# EAGLE design esp32_master_board (EAGLE 9.7.0)
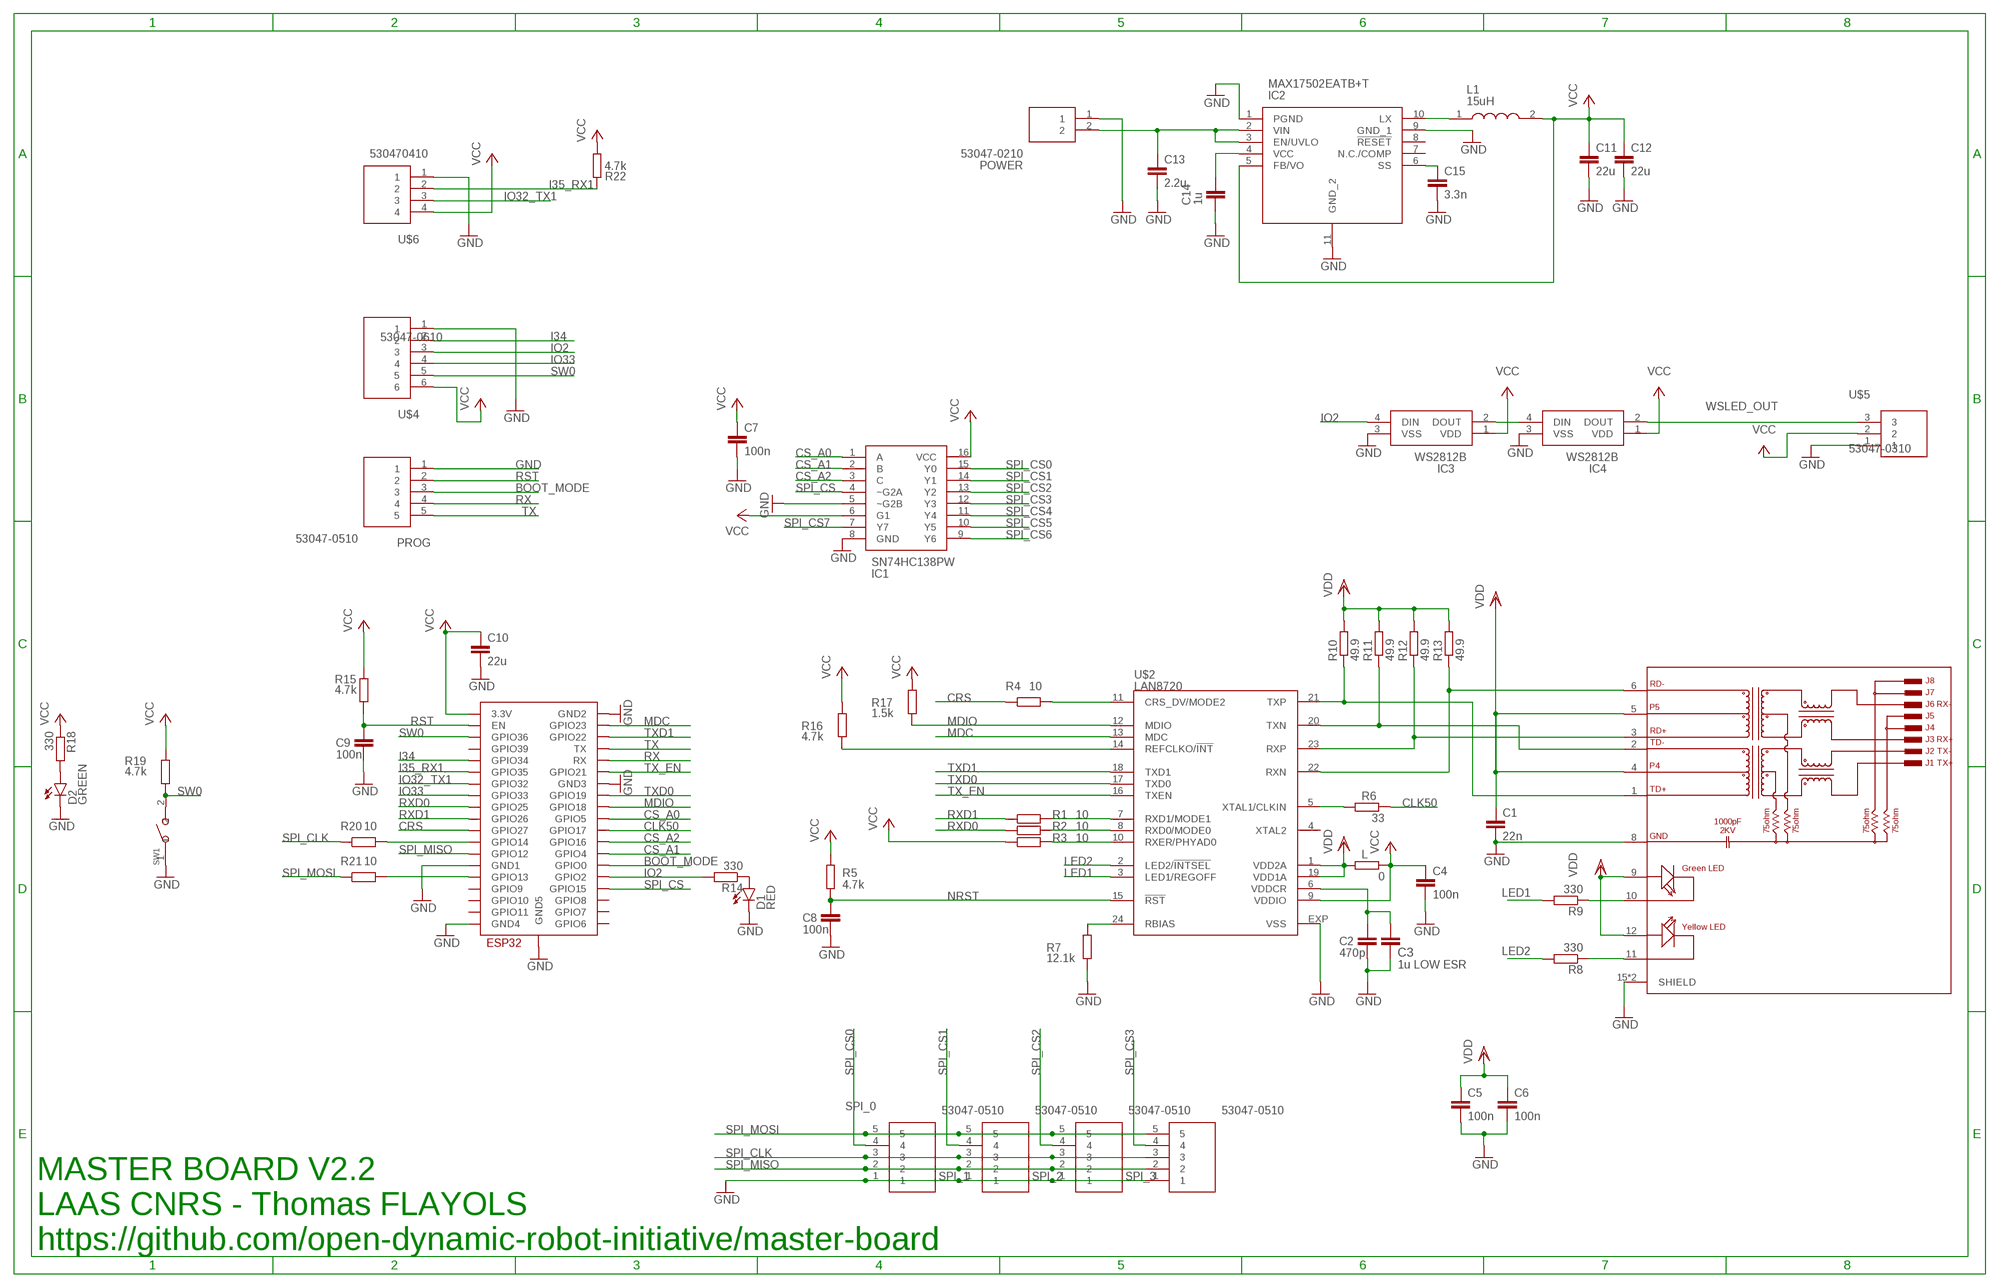
[diagram p0: schematic, sheet 1]

## Parts
C1  22n  C-EUC0402  [0402]
C2  470p  C-EUC0402  [0402]
C3  1u LOW ESR  C-EUC0402  [0402]
C4  100n  C-EUC0402  [0402]
C5  100n  C-EUC0402  [0402]
C6  100n  C-EUC0402  [0402]
C7  100n  C-EUC0402  [0402]
C8  100n  C-EUC0402  [0402]
C9  100n  C-EUC0402  [0402]
C10  22u  C-EUC0805  [C0805]
C11  22u  C-EUC0805  [C0805]
C12  22u  C-EUC0805  [C0805]
C13  2.2u  C-EUC1210  [C1210]
C14  1u  C-EUC0402  [0402]
C15  3.3n  C-EUC0402  [0402]
D1  RED  LEDCHIPLED_0603  [CHIPLED_0603]
D2  GREEN  LEDCHIPLED_0603  [CHIPLED_0603]
IC1  SN74HC138PW  [SOP65P640X120-16N]
IC2  MAX17502EATB+T  [SON50P200X300X80-11N]
IC3  WS2812B  [WS2812B]
IC4  WS2812B  [WS2812B]
L  0  R-EU_R0402  [0402]
L1  15uH  LPS6235-153MRB  [LPS6235]
POWER  53047-0210  [530470210]
PROG  53047-0510  [530470510]
R1  10  R-EU_R0402  [0402]
R2  10  R-EU_R0402  [0402]
R3  10  R-EU_R0402  [0402]
R4  10  R-EU_R0402  [0402]
R5  4.7k  R-EU_R0402  [0402]
R6  33  R-EU_R0402  [0402]
R7  12.1k  R-EU_R0402  [0402]
R8  330  R-EU_R0402  [0402]
R9  330  R-EU_R0402  [0402]
R10  49.9  R-EU_R0402  [0402]
R11  49.9  R-EU_R0402  [0402]
R12  49.9  R-EU_R0402  [0402]
R13  49.9  R-EU_R0402  [0402]
R14  330  R-EU_R0402  [0402]
R15  4.7k  R-EU_R0402  [0402]
R16  4.7k  R-EU_R0402  [0402]
R17  1.5k  R-EU_R0402  [0402]
R18  330  R-EU_R0402  [0402]
R19  4.7k  R-EU_R0402  [0402]
R20  10  R-EU_R0402  [0402]
R21  10  R-EU_R0402  [0402]
R22  4.7k  R-EU_R0402  [0402]
SPI_0  53047-0510  [530470510]
SPI_1  53047-0510  [530470510]
SPI_2  53047-0510  [530470510]
SPI_3  53047-0510  [530470510]
SW1  B3U-1000P-2P-SMD  SMD-BUTTON(2P-3.0X2.5X1.2+0.4MM)-B3U-1000P-2P-SMD  [SW2-2.6-3.0X2.5X1.2+0.4MM]
U$1  ESP32-WROOM  [ESP32-WROOM]
U$2  LAN8720  [QFN24]
U$3  HR911105A  [HANRUN_HR911105A]
U$4  53047-0610  [530470610]
U$5  53047-0310  [530470310]
U$6  530470410  [530470410]

## Nets
BOOT_MODE: PROG.3 U$1.IO0(GPIO0)
CLK50: R6.1 U$1.IO17(GPIO17)
CRS: R4.1 U$1.IO27(GPIO27)
CS_A0: IC1.1(A) U$1.IO5(GPIO5)
CS_A1: IC1.2(B) U$1.IO4(GPIO4)
CS_A2: IC1.3(C) U$1.IO16(GPIO16)
GND: C1.2 C2.2 C3.2 C4.2 C5.2 C6.2 C7.2 C8.2 C9.2 C10.2 C11.2 C12.2 C13.2 C14.1 C15.2 D1.C D2.C IC1.5(~G2B) IC1.8(GND) IC2.1(PGND) IC2.9(GND_1) IC2.11(GND_2) IC3.3(VSS) IC4.3(VSS) POWER.1 PROG.1 R7.1 SPI_0.1 SPI_1.1 SPI_2.1 SPI_3.1 SW1.1 U$1.GND1 U$1.GND2 U$1.GND3 U$1.GND4 U$1.GND5 U$2.EXP(VSS) U$3.8(GND) U$3.15(SHIELD) U$3.16(SHIELD) U$4.1 U$5.1 U$6.1
I34: U$1.IO34(GPIO34) U$4.2
I35_RX1: R22.2 U$1.IO35(GPIO35) U$6.2
IO2: IC3.4(DIN) R14.2 U$1.IO2(GPIO2) U$4.3
IO32_TX1: U$1.IO32(GPIO32) U$6.3
IO33: U$1.IO33(GPIO33) U$4.4
LED1: R9.2 U$2.3(LED1/REGOFF)
LED2: R8.2 U$2.2(LED2/!INTSEL)
MDC: U$1.IO23(GPIO23) U$2.13(MDC)
MDIO: R17.1 U$1.IO18(GPIO18) U$2.12(MDIO)
N$1: R1.2 U$2.7(RXD1/MODE1)
N$2: R2.2 U$2.8(RXD0/MODE0)
N$3: R3.2 U$2.10(RXER/PHYAD0)
N$4: R4.2 U$2.11(CRS_DV/MODE2)
N$5: R6.2 U$2.5(XTAL1/CLKIN)
N$6: R7.2 U$2.24(RBIAS)
N$7: R10.1 U$2.21(TXP) U$3.1(TD+)
N$8: R11.1 U$2.20(TXN) U$3.2(TD-)
N$9: R12.1 U$2.23(RXP) U$3.3(RD+)
N$10: R13.1 U$2.22(RXN) U$3.6(RD-)
N$11: R8.1 U$3.11(YC)
N$12: R9.1 U$3.10(GC)
N$13: R16.1 U$2.14(REFCLKO/!INT)
N$14: C2.1 C3.1 U$2.6(VDDCR)
N$15: C14.2 IC2.4(VCC)
N$16: D1.A R14.1
N$17: R21.2 U$1.IO13(GPIO13)
N$18: IC2.10(LX) L1.1
N$19: IC3.2(DOUT) IC4.4(DIN)
N$20: D2.A R18.2
N$21: R20.2 U$1.IO14(GPIO14)
N$23: C15.1 IC2.6(SS)
N$25: C13.1 IC2.2(VIN) IC2.3(EN/UVLO) POWER.2
NRST: C8.1 R5.1 U$2.15(!RST)
RST: C9.1 PROG.2 R15.1 U$1.EN
RX: PROG.4 U$1.RX
RXD0: R2.1 U$1.IO25(GPIO25)
RXD1: R1.1 U$1.IO26(GPIO26)
SPI_CLK: R20.1 SPI_0.3 SPI_1.3 SPI_2.3 SPI_3.3
SPI_CS: IC1.4(~G2A) U$1.IO15(GPIO15)
SPI_CS0: IC1.15(Y0) SPI_0.4
SPI_CS1: IC1.14(Y1) SPI_1.4
SPI_CS2: IC1.13(Y2) SPI_2.4
SPI_CS3: IC1.12(Y3) SPI_3.4
SPI_CS4: IC1.11(Y4)
SPI_CS5: IC1.10(Y5)
SPI_CS6: IC1.9(Y6)
SPI_CS7: IC1.7(Y7)
SPI_MISO: SPI_0.2 SPI_1.2 SPI_2.2 SPI_3.2 U$1.IO12(GPIO12)
SPI_MOSI: R21.1 SPI_0.5 SPI_1.5 SPI_2.5 SPI_3.5
SW0: R19.1 SW1.2 U$1.SENSOR_VP(GPIO36) U$4.5
TX: PROG.5 U$1.TX
TX_EN: U$1.IO21(GPIO21) U$2.16(TXEN)
TXD0: U$1.IO19(GPIO19) U$2.17(TXD0)
TXD1: U$1.IO22(GPIO22) U$2.18(TXD1)
VCC [power]: C4.1 C7.1 C10.1 C11.1 C12.1 IC1.6(G1) IC1.16(VCC) IC2.5(FB/VO) IC3.1(VDD) IC4.1(VDD) L1.2 L.1 R3.1 R5.2 R15.2 R16.2 R17.2 R18.1 R19.2 R22.1 U$1.3V3(3.3V) U$2.9(VDDIO) U$4.6 U$5.2 U$6.4
VDD [power]: C1.1 C5.1 C6.1 L.2 R10.2 R11.2 R12.2 R13.2 U$2.1(VDD2A) U$2.19(VDD1A) U$3.4 U$3.5 U$3.9(GA) U$3.12(YA)
WSLED_OUT: IC4.2(DOUT) U$5.3
Unconnected: IC2.7(N.C./COMP) IC2.8(!RESET) U$1.CLK(GPIO6) U$1.CMD(GPIO11) U$1.SD0(GPIO7) U$1.SD1(GPIO8) U$1.SD2(GPIO9) U$1.SD3(GPIO10) U$1.SENSOR_VN(GPIO39) U$2.4(XTAL2)

## Notes on the sheet
- MASTER BOARD V2.2
  LAAS CNRS - Thomas FLAYOLS
  https://github.com/open-dynamic-robot-initiative/master-board

## Library data of the parts
C1 = resistor:C-EU: CAPACITOR, European symbol; MANUFACTURER_PART_NUMBER: 885012205052
C2 = resistor:C-EU: CAPACITOR, European symbol; MANUFACTURER_PART_NUMBER: CL05C471JB5NNNC
C3 C14 = resistor:C-EU: CAPACITOR, European symbol; MANUFACTURER_PART_NUMBER: CPL-CAP-X5R-0402-1UF-6.3V
C4-C9 = resistor:C-EU: CAPACITOR, European symbol; MANUFACTURER_PART_NUMBER: CPL-CAP-X7R-0402-100NF-16V
C10-C12 = rcl:C-EU: CAPACITOR, European symbol; MANUFACTURER_PART_NUMBER: CPL-CAP-X5R-0805-22UF-6.3V; SPICEPREFIX: C
C13 = resistor:C-EU: CAPACITOR, European symbol; MANUFACTURER_PART_NUMBER: C3225X7R1H225K250AB
C15 = resistor:C-EU: CAPACITOR, European symbol; MANUFACTURER_PART_NUMBER: 885012205064
D1 = led:LED: LED OSRAM: - CHIPLED LG R971, LG N971, LY N971, LG Q971, LY Q971, LO R971, LY R971 LH N974, LH R974 LS Q976, LO Q976, LY Q976 LO Q996 - Hyper CHIPLED LW Q18S LB Q993, LB Q99A, LB R99A - SideLED LS A670, LO A670, LY A670, LG A670, LP A670 LB A673, LV A673, LT A673, LW A673 LH A674 LY A675 LS A676, LA A676, LO A676, LY A676, LW A676 LS A679, LY A679, LG A679 - Hyper Micro SIDELED® LS Y876, LA Y876, LO Y876, LY Y876 LT Y87S - SmartLED LW L88C, LW L88S LB L89C, LB L89S, LG L890 LS L89K, LO L89K, LY L89K LS L896, LA L896, LO L896, LY L896 - TOPLED LS T670, LO T670, LY T670, LG T670, LP T670 LSG T670, LSP T670, LSY T670, LOP T670, LYG T670 LG T671, LOG T671, LSG T671 LB T673, LV T673, LT T673, LW T673 LH T674 LS T676, LA T676, LO T676, LY T676, LB T676, LH T676, LSB T676, LW T676 LB T67C, LV T67C, LT T67C, LS T67K, LO T67K, LY T67K, LW E67C LS E67B, LA E67B, LO E67B, LY E67B, LB E67C, LV E67C, LT E67C LW T67C LS T679, LY T679, LG T679 LS T770, LO T770, LY T770, LG T770, LP T770 LB T773, LV T773, LT T773, LW T773 LH T774 LS E675, LA E675, LY E675, LS T675 LS T776, LA T776, LO T776, LY T776, LB T776 LHGB T686 LT T68C, LB T68C - Hyper Mini TOPLED® LB M676 - Mini TOPLED Santana® LG M470 LS M47K, LO M47K, LY M47K Source: http://www.osram.convergy.de LUXEON: - LUMILED® LXK2-PW12-R00, LXK2-PW12-S00, LXK2-PW14-U00, LXK2-PW14-V00 LXK2-PM12-R00, LXK2-PM12-S00, LXK2-PM14-U00 LXK2-PE12-Q00, LXK2-PE12-R00, LXK2-PE12-S00, LXK2-PE14-T00, LXK2-PE14-U00 LXK2-PB12-K00, LXK2-PB12-L00, LXK2-PB12-M00, LXK2-PB14-N00, LXK2-PB14-P00, LXK2-PB14-Q00 LXK2-PR12-L00, LXK2-PR12-M00, LXK2-PR14-Q00, LXK2-PR14-R00 LXK2-PD12-Q00, LXK2-PD12-R00, LXK2-PD12-S00 LXK2-PH12-R00, LXK2-PH12-S00 LXK2-PL12-P00, LXK2-PL12-Q00, LXK2-PL12-R00 Source: www.luxeon.com KINGBRIGHT: KA-3528ASYC Source: www.kingbright.com; MANUFACTURER_PART_NUMBER: CPL-LED-0603-RED
D2 = led:LED: LED OSRAM: - CHIPLED LG R971, LG N971, LY N971, LG Q971, LY Q971, LO R971, LY R971 LH N974, LH R974 LS Q976, LO Q976, LY Q976 LO Q996 - Hyper CHIPLED LW Q18S LB Q993, LB Q99A, LB R99A - SideLED LS A670, LO A670, LY A670, LG A670, LP A670 LB A673, LV A673, LT A673, LW A673 LH A674 LY A675 LS A676, LA A676, LO A676, LY A676, LW A676 LS A679, LY A679, LG A679 - Hyper Micro SIDELED® LS Y876, LA Y876, LO Y876, LY Y876 LT Y87S - SmartLED LW L88C, LW L88S LB L89C, LB L89S, LG L890 LS L89K, LO L89K, LY L89K LS L896, LA L896, LO L896, LY L896 - TOPLED LS T670, LO T670, LY T670, LG T670, LP T670 LSG T670, LSP T670, LSY T670, LOP T670, LYG T670 LG T671, LOG T671, LSG T671 LB T673, LV T673, LT T673, LW T673 LH T674 LS T676, LA T676, LO T676, LY T676, LB T676, LH T676, LSB T676, LW T676 LB T67C, LV T67C, LT T67C, LS T67K, LO T67K, LY T67K, LW E67C LS E67B, LA E67B, LO E67B, LY E67B, LB E67C, LV E67C, LT E67C LW T67C LS T679, LY T679, LG T679 LS T770, LO T770, LY T770, LG T770, LP T770 LB T773, LV T773, LT T773, LW T773 LH T774 LS E675, LA E675, LY E675, LS T675 LS T776, LA T776, LO T776, LY T776, LB T776 LHGB T686 LT T68C, LB T68C - Hyper Mini TOPLED® LB M676 - Mini TOPLED Santana® LG M470 LS M47K, LO M47K, LY M47K Source: http://www.osram.convergy.de LUXEON: - LUMILED® LXK2-PW12-R00, LXK2-PW12-S00, LXK2-PW14-U00, LXK2-PW14-V00 LXK2-PM12-R00, LXK2-PM12-S00, LXK2-PM14-U00 LXK2-PE12-Q00, LXK2-PE12-R00, LXK2-PE12-S00, LXK2-PE14-T00, LXK2-PE14-U00 LXK2-PB12-K00, LXK2-PB12-L00, LXK2-PB12-M00, LXK2-PB14-N00, LXK2-PB14-P00, LXK2-PB14-Q00 LXK2-PR12-L00, LXK2-PR12-M00, LXK2-PR14-Q00, LXK2-PR14-R00 LXK2-PD12-Q00, LXK2-PD12-R00, LXK2-PD12-S00 LXK2-PH12-R00, LXK2-PH12-S00 LXK2-PL12-P00, LXK2-PL12-Q00, LXK2-PL12-R00 Source: www.luxeon.com KINGBRIGHT: KA-3528ASYC Source: www.kingbright.com; MANUFACTURER_PART_NUMBER: CPL-LED-0603-GREEN
IC1 = SamacSys_Parts:SN74HC138PW: Texas Instruments SN74HC138PW, Decoder, Demultiplexer, 1-of-8, Inverting, 2 6 V, 16-Pin TSSOP Source: Datasheet <http://www.ti.com/lit/gpn/sn74hc138>; DESCRIPTION: Texas Instruments SN74HC138PW, Decoder, Demultiplexer, 1-of-8, Inverting, 2 6 V, 16-Pin TSSOP; HEIGHT: mm; MANUFACTURER_NAME: Texas Instruments; MANUFACTURER_PART_NUMBER: SN74HC138PW; RS_PART_NUMBER: 6631928; RS_PRICE-STOCK: https://uk.rs-online.com/web/p/products/6631928
IC2 = MAX17502EATB+T:MAX17502EATB+T: MAXIM INTEGRATED PRODUCTS - MAX17502EATB+T - DC/DC CONV, SYNC BUCK, 600KHZ, 125DEG C Source: Datasheet <https://datasheets.maximintegrated.com/en/ds/MAX17502.pdf>; DESCRIPTION: MAXIM INTEGRATED PRODUCTS - MAX17502EATB+T - DC/DC CONV, SYNC BUCK, 600KHZ, 125DEG C; HEIGHT: 0.8mm; MANUFACTURER_NAME: Maxim Integrated; MANUFACTURER_PART_NUMBER: MAX17502EATB+T; MOUSER_PART_NUMBER: 700-MAX17502EATB+T; MOUSER_PRICE-STOCK: https://www.mouser.com/Search/Refine.aspx?Keyword=700-MAX17502EATB%2BT
IC3 IC4 = WS2812B:WS2812B: Intelligent control LED integrated light source Source: Datasheet <https://www.adafruit.com/datasheets/WS2812B.pdf>; DESCRIPTION: Intelligent control LED integrated light source; HEIGHT: mm; MANUFACTURER_NAME: Worldsemi; MANUFACTURER_PART_NUMBER: WS2812B
L = resistor:R-EU_: RESISTOR, European symbol; MANUFACTURER_PART_NUMBER: CPL-RES-0402-0-0.063W
L1 = LPS6235-153MRB:LPS6235-153MRB: COILCRAFT - LPS6235-153MRB - INDUCTOR, SHLD, 15UH, 20%, 1.7A, SMD Source: Datasheet <https://www.mouser.fr/datasheet/2/597/lps6235-270704.pdf>; DESCRIPTION: COILCRAFT - LPS6235-153MRB - INDUCTOR, SHLD, 15UH, 20%, 1.7A, SMD; HEIGHT: mm; MANUFACTURER_NAME: COILCRAFT; MANUFACTURER_PART_NUMBER: LPS6235-153MRB; MOUSER_PART_NUMBER: 994-LPS6235-153MRB; MOUSER_PRICE-STOCK: https://www.mouser.com/Search/Refine.aspx?Keyword=994-LPS6235-153MRB
POWER = 53047-0210:53047-0210: Headers & Wire Housings VERTICAL HDR 2P Source: Datasheet <https://componentsearchengine.com/Datasheets/2/53047-0210.pdf>; DESCRIPTION: Headers & Wire Housings VERTICAL HDR 2P; HEIGHT: 4.4mm; MANUFACTURER_NAME: Molex; MANUFACTURER_PART_NUMBER: DF13-3P-1.25DSA; MOUSER_PART_NUMBER: 538-53047-0210; MOUSER_PRICE-STOCK: https://www.mouser.co.uk/ProductDetail/Molex/53047-0210?qs=M5Ic86%252BuP8b8FQrTwriyOw%3D%3D
PROG SPI_0 SPI_1-SPI_3 = 53047-0510:53047-0510: Headers & Wire Housings VERTICAL HDR 5P Source: Datasheet <https://www.molex.com/pdm_docs/sd/530470210_sd.pdf>; ARROW_PART_NUMBER: 53047-0510; ARROW_PRICE-STOCK: https://www.arrow.com/en/products/53047-0510/molex?region=nac; DESCRIPTION: Headers & Wire Housings VERTICAL HDR 5P; HEIGHT: 4.2mm; MANUFACTURER_NAME: Molex; MANUFACTURER_PART_NUMBER: DF13-5P-1.25DSA; MOUSER_PART_NUMBER: 538-53047-0510; MOUSER_PRICE-STOCK: https://www.mouser.co.uk/ProductDetail/Molex/53047-0510?qs=KC2ywxza1koXSHAr3dqR%2FQ%3D%3D
R1-R4 R20 R21 = resistor:R-EU_: RESISTOR, European symbol; MANUFACTURER_PART_NUMBER: CPL-RES-0402-10-0.063W
R5 R15 R16 R19 R22 = resistor:R-EU_: RESISTOR, European symbol; MANUFACTURER_PART_NUMBER: CPL-RES-0402-4.7K-0.063W
R6 = resistor:R-EU_: RESISTOR, European symbol; MANUFACTURER_PART_NUMBER: CRCW040233R0FKEDC
R7 = resistor:R-EU_: RESISTOR, European symbol; MANUFACTURER_PART_NUMBER: ERJ-U02F1212X
R8 R9 R14 R18 = resistor:R-EU_: RESISTOR, European symbol; MANUFACTURER_PART_NUMBER: RC0402JR-13330RL
R10-R13 = resistor:R-EU_: RESISTOR, European symbol; MANUFACTURER_PART_NUMBER: CRCW040249R9FKEDC
R17 = resistor:R-EU_: RESISTOR, European symbol; MANUFACTURER_PART_NUMBER: ERJ2GEJ152X
SW1 = OPL_Switch:SMD-BUTTON(2P-3.0X2.5X1.2+0.4MM): 311020047; MANUFACTURER_PART_NUMBER: B3U-1000P; MPN: B3U-1000P-2P-SMD
U$1 = ESP32:ESP32-WROOM; MANUFACTURER_PART_NUMBER: ESP32-WROOM-32D
U$2 = microchip-smsc-lan8720:LAN8720: LAN8720A/LAN8720Ai Small Footprint RMII 10/100 Ethernet PHY Transceiver with HP Auto-MDIX Support from SMSC / Microchip <http://www.microchip.com>. (C) 2014 Tomasz Boleslaw CEDRO, cederom@tlen.pl, http://www.tomek.cedro.info. Version 0.1 (2014-01-04): Initial release.; MANUFACTURER_PART_NUMBER: LAN8720A-CP
U$3 = HR911105A_bis:HR911105A: DIP RJ45 Connector; Check prices <https://pricing.snapeda.com/parts/HR911105A/DFRobot/view-part?ref=eda>; AVAILABILITY: Not in stock; DESCRIPTION: HR911105A Ethernet Interface Arduino Platform Evaluation Expansion Board; MANUFACTURER_PART_NUMBER: HR911105A; MF: DFRobot; MP: HR911105A; PACKAGE: None; PRICE: None
U$4 = 53047-0610:53047-0610: Headers & Wire Housings VERTICAL HDR 6P Source: Datasheet <https://www.molex.com/pdm_docs/sd/530470210_sd.pdf>; DESCRIPTION: Headers & Wire Housings VERTICAL HDR 6P; HEIGHT: 4.2mm; MANUFACTURER_NAME: Molex; MANUFACTURER_PART_NUMBER: DF13-6P-1.25DSA; MOUSER_PART_NUMBER: 538-53047-0610; MOUSER_PRICE-STOCK: https://www.mouser.co.uk/ProductDetail/Molex/53047-0610?qs=W6FIH8d5%2F%2F2fC3kTOlN%2FUQ%3D%3D
U$5 = 53047-0310:53047-0310: Headers & Wire Housings VERTICAL HDR 3P Source: Datasheet <https://www.molex.com/pdm_docs/sd/530470310_sd.pdf>; ARROW_PART_NUMBER: 53047-0310; ARROW_PRICE-STOCK: https://www.arrow.com/en/products/53047-0310/molex?region=nac; DESCRIPTION: Headers & Wire Housings VERTICAL HDR 3P; HEIGHT: 4.4mm; MANUFACTURER_NAME: Molex; MANUFACTURER_PART_NUMBER: DF13-3P-1.25DSA; MOUSER_PART_NUMBER: 538-53047-0310; MOUSER_PRICE-STOCK: https://www.mouser.co.uk/ProductDetail/Molex/53047-0310?qs=WvGHgJyR8NxkapfSzLYEEg%3D%3D
U$6 = 530470410:530470410: 1.25mm Pitch, PicoBlade PCB Header, Single Row, Vertical, Through Hole, Tin Plating, Friction Lock, 4 Circuits, Tray, 2.30mm PC Tail Length Source: Datasheet <https://www.molex.com/pdm_docs/sd/530470210_sd.pdf>; ARROW_PART_NUMBER: 530470410; ARROW_PRICE-STOCK: https://www.arrow.com/en/products/53047-0410/molex?region=nac; DESCRIPTION: 1.25mm Pitch, PicoBlade PCB Header, Single Row, Vertical, Through Hole, Tin Plating, Friction Lock, 4 Circuits, Tray, 2.30mm PC Tail Length; HEIGHT: 4.2mm; MANUFACTURER_NAME: Molex; MANUFACTURER_PART_NUMBER: DF13-4P-1.25DSA

## Net classes
1 power: width 0.406 mm

## Board
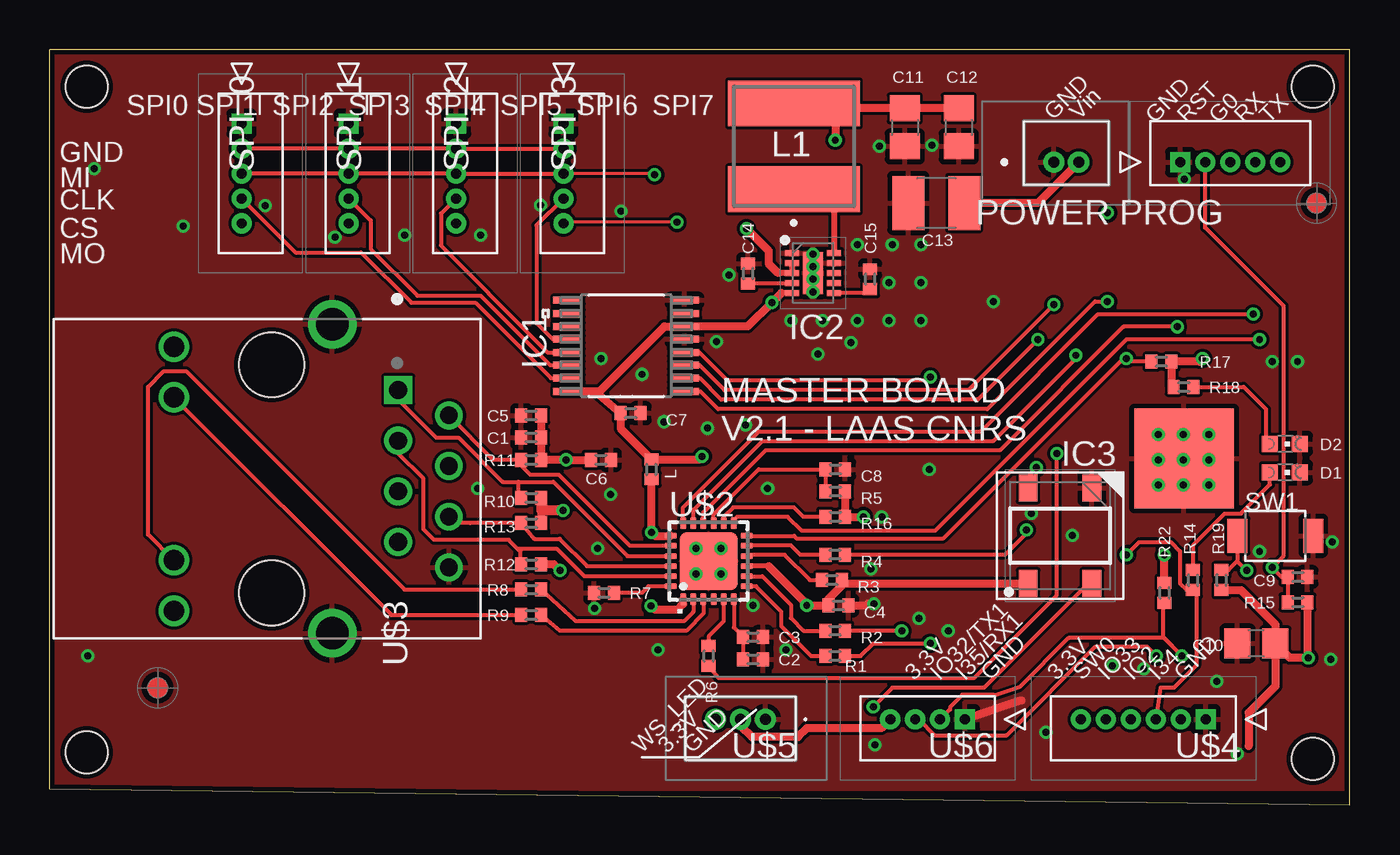
[diagram p1: board, top side]
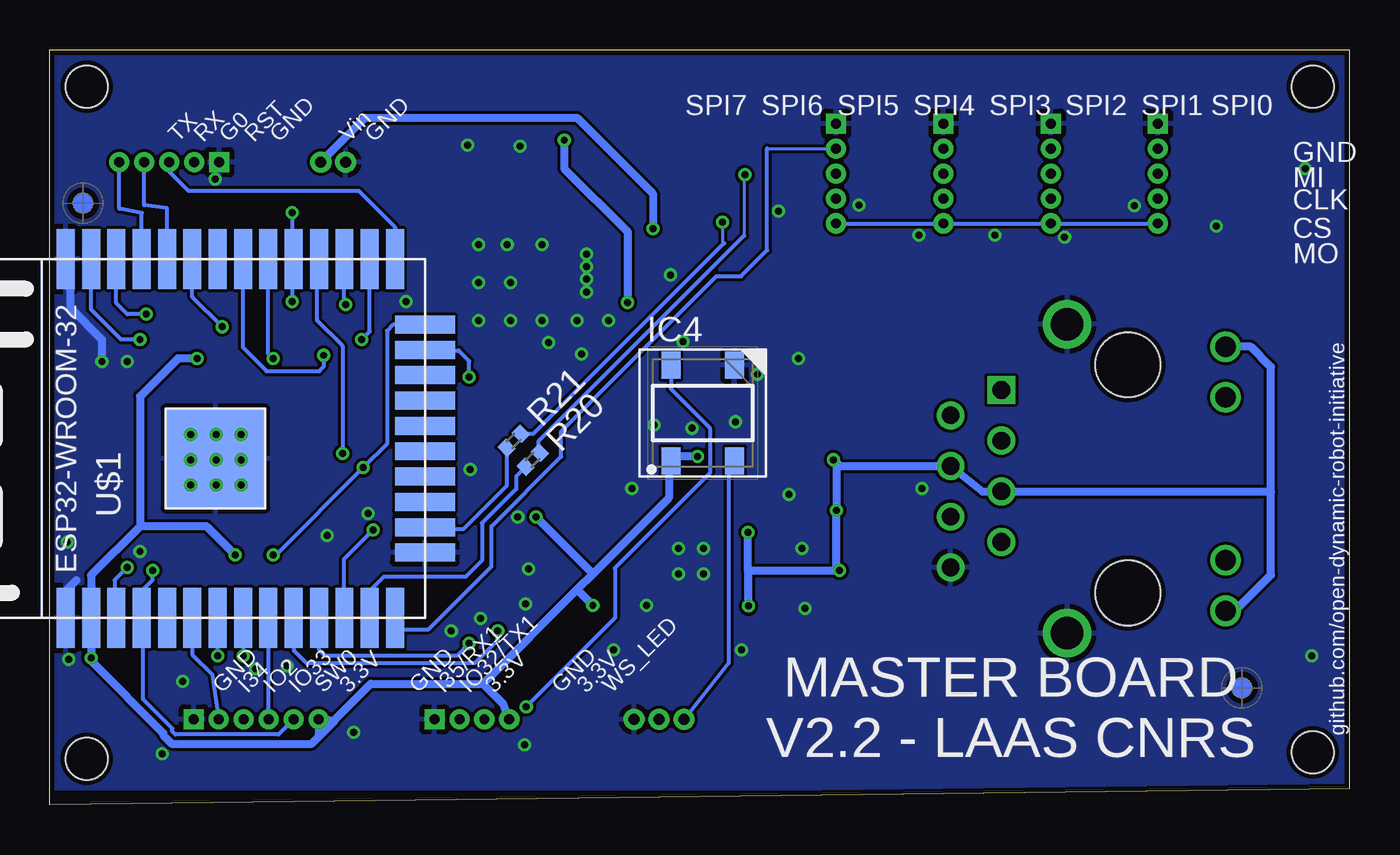
[diagram p2: board, bottom side, seen from below]

Size 65.16 x 37.86 mm. Coordinates in mm from the lower left corner, seen from the top.
Outline: 0,37.86 65.16,37.86 65.16,0 0,0.79 0,37.85
Copper layers (1*16): Top 0.035mm / dielectric 1.5mm / Bottom 0.035mm
Design rules "SeeedStudio": minimum track width 6mil, minimum drill 12mil, track to track 6mil, track to pad 6mil, pad to pad 6mil, via to via 6mil, smd to smd 0mil, copper to edge 10mil, drill to drill 10mil, minimum pad ring 10mil, minimum via ring 6mil, stop-mask expansion 2mil, vias tented up to drill 100mil, thermal gap 10mil
Holes 2.1 mm at 1.84,36.02 1.84,2.64 63.32,2.32 63.32,36.02

### Footprints (pad centres in the part's own frame; a part is rotated, then mirrored left to right if it is on the bottom)
0402 = smd 0.6 x 0.7: 1 -0.5,0; 2 0.5,0
C0805 = smd 1.3 x 1.5: 1 -0.95,0; 2 0.95,0
C1210 = smd 1.6 x 2.7: 1 -1.4,0; 2 1.4,0
CHIPLED_0603 = smd 0.8 x 0.8: A 0,-0.75; C 0,0.75
SOP65P640X120-16N = smd 1.473 x 0.356: 1 -2.921,2.286; 2 -2.921,1.626; 3 -2.921,0.965; 4 -2.921,0.33; 5 -2.921,-0.33; 6 -2.921,-0.965; 7 -2.921,-1.626; 8 -2.921,-2.286; 9 2.921,-2.286; 10 2.921,-1.626; 11 2.921,-0.965; 12 2.921,-0.33; 13 2.921,0.33; 14 2.921,0.965; 15 2.921,1.626; 16 2.921,2.286
SON50P200X300X80-11N = smd 0.7 x 0.3: 1 -1.05,1; 2 -1.05,0.5; 3 -1.05,0; 4 -1.05,-0.5; 5 -1.05,-1; 6 1.05,-1; 7 1.05,-0.5; 8 1.05,0; 9 1.05,0.5; 10 1.05,1 | smd 1 x 2.1: 11 0,0
WS2812B = smd 1.35 x 0.95: 1 -2.4,1.6; 2 -2.4,-1.6; 3 2.4,-1.6; 4 2.4,1.6
LPS6235 = smd 2.3 x 6.6: 1 -2.15,0; 2 2.15,0
530470210 = drill 0.55 pad 1: 1 0,0; 2 -1.25,0
530470510 = drill 0.5 pad 0.85 square: 1 0,0 | drill 0.5 pad 0.85: 2 -1.25,0; 3 -2.5,0; 4 -3.75,0; 5 -5,0
SW2-2.6-3.0X2.5X1.2+0.4MM = smd 1 x 1.7: 1 -1.9,0; 2 1.9,0
ESP32-WROOM = smd 3 x 0.9: 3V3 0,16.74; EN 0,15.47; GND1 0,18.01; GND3 18,18.01; IO0 18,1.5; IO4 18,2.77; IO5 18,6.58; IO12 0,1.5; IO14 0,2.77; IO16 18,4.04; IO17 18,5.31; IO18 18,7.85; IO19 18,9.12; IO21 18,11.66; IO22 18,15.47; IO23 18,16.74; IO25 0,6.58; IO26 0,5.31; IO27 0,4.04; IO32 0,9.12; IO33 0,7.85; IO34 0,11.66; IO35 0,10.39; NC 18,10.39; RX 18,12.93; SENSOR_VN 0,12.93; SENSOR_VP 0,14.2; TX 18,14.2 | smd 0.9 x 3: CLK 9.635,0; CMD 8.365,0; GND2 3.285,0; IO2 14.715,0; IO13 4.555,0; IO15 13.445,0; SD0 10.905,0; SD1 12.175,0; SD2 5.825,0; SD3 7.095,0 | smd 5 x 5: GND4 8,10.5 | smd 5 x 5 bottom: GND5 8,10.5
QFN24 = smd 0.6 x 0.3: 1 -1.905,1.27; 2 -1.905,0.762; 3 -1.905,0.254; 4 -1.905,-0.254; 5 -1.905,-0.762; 6 -1.905,-1.27; 13 1.905,-1.27; 14 1.905,-0.762; 15 1.905,-0.254; 16 1.905,0.254; 17 1.905,0.762; 18 1.905,1.27 | smd 0.3 x 0.6: 7 -1.27,-1.905; 8 -0.762,-1.905; 9 -0.254,-1.905; 10 0.254,-1.905; 11 0.762,-1.905; 12 1.27,-1.905; 19 1.27,1.905; 20 0.762,1.905; 21 0.254,1.905; 22 -0.254,1.905; 23 -0.762,1.905; 24 -1.27,1.905 | smd 2.9 x 2.9: EXP 0,0
HANRUN_HR911105A = drill 0.89 square: 1 4.45,-6.35 | drill 0.89: 2 3.18,-8.89; 3 1.91,-6.35; 4 0.64,-8.89; 5 -0.63,-6.35; 6 -1.9,-8.89; 7 -3.17,-6.35; 8 -4.44,-8.89 | drill 1.02: 9 6.625,4.9; 10 4.085,4.9; 11 -4.085,4.9; 12 -6.625,4.9 | drill 1.63: 15 7.745,-3.05; 16 -7.745,-3.05 | hole 3.25: -5.715,0; 5.715,0
530470610 = drill 0.5 pad 0.85 square: 1 0,0 | drill 0.5 pad 0.85: 2 -1.25,0; 3 -2.5,0; 4 -3.75,0; 5 -5,0; 6 -6.25,0
530470310 = drill 0.55 pad 0.9: 1 0,0; 2 -1.25,0; 3 -2.5,0
530470410 = drill 0.5 pad 0.85 square: 1 0,0 | drill 0.5 pad 0.85: 2 -1.25,0; 3 -2.5,0; 4 -3.75,0

### Placement (x,y rotation side)
C1  24.13,18.41 180 top
C2  35.24,7.3 0 top
C3  35.24,8.41 0 top
C4  39.53,10 0 top
C5  24.13,19.53 180 top
C6  27.62,17.3 0 top
C7  29.11,19.64 0 top
C8  39.37,16.83 0 top
C9  62.55,11.43 0 top
C10  60.48,8.1 180 top
C11  42.86,33.97 270 top
C12  45.56,33.97 270 top
C13  44.44,30.18 180 top
C14  35.01,26.64 270 top
C15  41.12,26.35 90 top
D1  61.91,16.67 270 top
D2  61.91,18.1 270 top
IC1  28.89,23.02 180 top
IC2  38.26,26.67 0 top
IC3  50.64,13.49 90 top
IC4  32.43,19.65 90 bottom
L  30.16,16.83 270 top
L1  37.31,33.02 90 top
POWER  50.32,32.23 180 top
PROG  56.67,32.23 180 top
R1  39.37,7.46 180 top
R2  39.37,8.73 180 top
R3  39.21,11.27 180 top
R4  39.37,12.54 180 top
R5  39.37,15.72 0 top
R6  33.02,7.46 90 top
R7  27.78,10.64 0 top
R8  24.13,10.79 0 top
R9  24.13,9.53 0 top
R10  24.13,15.4 0 top
R11  24.13,17.3 0 top
R12  24.13,12.07 0 top
R13  24.13,14.13 0 top
R14  57.31,11.27 270 top
R15  62.55,10.16 0 top
R16  39.37,14.45 0 top
R17  55.72,22.22 0 top
R18  56.83,20.95 0 top
R19  58.74,11.27 270 top
R20  40.96,17.3 225 bottom
R21  41.91,18.26 225 bottom
R22  55.88,10.64 270 top
REF1  [VISION_REF10]  5.4,5.87 0 bottom
REF2  [VISION_REF10]  63.5,30.16 0 bottom
REF3  [VISION_REF10]  5.4,5.87 0 top
REF4  [VISION_REF10]  63.5,30.16 0 top
SPI_0  9.61,34.16 90 top
SPI_1  14.99,34.16 90 top
SPI_2  20.36,34.16 90 top
SPI_3  25.74,34.16 90 top
SW1  61.44,13.49 180 top
U$1  46.35,9.37 90 bottom
U$2  33.02,12.22 90 top
U$3  11.11,16.35 90 top
U$4  57.94,4.29 0 top
U$5  35.88,4.29 0 top
U$6  45.88,4.29 0 top

### Tracks (layer width: path | path; a pad name or v marks a point on that pad's centre or on a via)
BOOT_MODE
  Bottom 0.203: PROG.3 59.17,31.75 58.22,30.8 49.69,30.8 47.85,28.96 U$1.IO0
CLK50  (via drill 0.35)
  Top 0.203: v50.48,17.62 50.45,17.59 50.45,10.48 46.32,6.35 33.53,6.35 R6.1
  Bottom 0.203: v50.48,17.62 50.48,23.02 51.75,24.29 51.75,27.28 U$1.IO17
CRS  (via drill 0.35)
  Top 0.203: v48.95,13.78 48.95,13.62 47.87,12.54 R4.1
  Bottom 0.203: v48.95,13.78 50.4,12.34 U$1.IO27
CS_A0  (via drill 0.35)
  Top 0.203: IC1.1 32.61,20.73 33.5,19.84 46.99,19.84 52.39,25.24 v53.02,25.24
  Bottom 0.203: v53.02,29.69 53.02,27.45 U$1.IO5 53.02,27.28 v53.02,25.24
CS_A1  (via drill 0.35)
  Top 0.203: IC1.2 32.58,21.39 33.66,20.32 46.51,20.32 v49.53,23.34
  Bottom 0.203: U$1.IO4 49.12,23.74 v49.53,23.34
CS_A2  (via drill 0.35)
  Top 0.203: IC1.3 32.56,22.05 33.81,20.8 46.04,20.8 v50.32,25.08
  Bottom 0.203: U$1.IO16 50.4,25.15 v50.32,25.08
GND  (via drill 0.35)
  Top 0.406: U$2.EXP v32.38,12.86 | U$2.EXP v33.66,11.59 | U$2.EXP v32.38,11.59 | U$2.EXP v33.66,12.86 | C4.2 40.92,10 41,10.08 v41.32,10.08 | 48.71,5.24 U$6.1
  Bottom 0.203: U$1.GND1 64.36,10.72 | 64.36,26.11 U$1.GND3 | U$1.GND4 56.9,17.37 v58.1,18.57 | U$1.GND4 55.65,18.57 v55.56,18.57 | U$1.GND4 55.56,16.07 v55.56,16.03 | U$1.GND4 58.1,16.12 v58.1,16.03
  Bottom 0.406: 64.36,10.72 63.82,11.27 | 64.36,26.11 64.14,25.88 64.14,24.92 62.55,23.34 v62.55,22.22
  other vias: 56.83,17.3 56.83,18.57 55.56,17.3 56.83,16.03 58.1,17.3 47.31,25.24 64.29,13.18 2.22,31.91 1.91,7.46 30.48,7.78 27.62,22.38 28.1,15.56 44.22,33.08 30.8,19.21 60.64,12.7 27.46,12.86 49.2,14.62 44.08,16.82 35.24,10 27.3,9.84 43.57,9.36 29.69,21.59 38.26,26.35 38.26,26.99 38.26,27.62 38.26,25.72 45.03,8.72 35.99,15.87 33.42,23.24 38.5,22.61 32.97,18.88 34.87,19.04 41.16,11.83 34.06,26.57 51.26,13.51 36.91,7.77 53.26,6.98 21.43,15.88 41.35,3.01 54.84,6.82 61.28,22.22 40.16,23.18 41.59,33.02 58.5,6.18 41.7,14.44 37.15,24.29 40.48,24.29 42.07,24.29 43.66,24.29 43.66,26.19 38.73,24.29 40.48,28.1 43.66,28.1 42.23,28.1 42.07,26.19 64.21,7.3 49.92,3.64 17.78,28.58 21.59,28.58 24.59,30.08 6.69,29.03 14.29,28.46 10.79,30.04 56.87,31.38 28.62,29.77 59.52,2.57
  pour Top: 0,0.79 65.16,0.79 65.16,37.86 0,37.86
  pour Bottom: 0,0.79 65.16,0.79 65.16,37.86 0,37.86
I34
  Bottom 0.203: U$1.IO34 58.02,7.53 57.01,6.53 U$4.2
I35_RX1  (via drill 0.35)
  Top 0.203: R22.2 55.8,10.06 55.8,8.42 v56.76,7.47 55.87,8.36 51.06,8.36 48.6,5.89 47.33,5.47 47.28,5.52 45.75,5.52 45.12,4.9 45.12,4.78 U$6.2
  Bottom 0.203: U$1.IO35 56.74,7.48 v56.76,7.47
IO2  (via drill 0.35)
  Top 0.203: IC3.4 49.13,15.99 49.13,16.59 v49.45,16.91 | v53.98,12.54 54.61,13.18 56.2,13.18 56.66,12.72 56.66,11.1 56.99,10.77 R14.2 57.47,10.61 57.47,6.98 56.36,5.87 55.68,5.87 U$4.3
  Bottom 0.203: U$1.IO2 47.94,24.08 48.26,23.76 48.26,18.1 v49.45,16.91 53.82,12.54 v53.98,12.54
IO32_TX1  (via drill 0.35)
  Top 0.203: v55.48,7.46 55,7.94 52.42,7.94 47.98,3.49 44.35,3.49 43.56,4.29 U$6.3
  Bottom 0.203: U$1.IO32 v55.48,7.46
IO33
  Bottom 0.203: U$4.4 54.2,4.36 U$1.IO33
LED1
  Top 0.203: R9.2 25.57,8.73 31.91,8.73 32.77,9.59 U$2.3
LED2
  Top 0.203: U$2.2 32.26,9.68 31.78,9.21 26.37,9.21 R8.2
MDC  (via drill 0.35)
  Top 0.203: v60.64,23.34 v60.64,23.33 53.97,23.33 44.38,13.74 37.69,13.74 36.99,14.45 34.45,14.45 34.29,14.29 U$2.13
  Bottom 0.203: v60.64,23.34 61.59,23.34 63.09,24.84 U$1.IO23
MDIO  (via drill 0.35)
  Top 0.203: U$2.12 37.31,13.49 37.47,13.33 44.77,13.33 53.82,22.38 v53.98,22.38 54.13,22.22 R17.1
  Bottom 0.203: U$1.IO18 54.2,22.61 v53.98,22.38
N$1
  Top 0.203: R1.2 38.16,7.46 36.67,8.95 36.67,9.68 35.4,10.95 U$2.7
N$2
  Top 0.203: R2.2 37.78,8.73 37.15,9.37 37.15,10.03 35.72,11.46 U$2.8
N$3
  Top 0.203: R3.2 38.1,11.27 36.83,12.54 34.99,12.54 U$2.10
N$4
  Top 0.203: U$2.11 34.96,13.02 37.15,13.02 37.62,12.54 R4.2
N$5
  Top 0.203: R6.2 33.02,8.44 33.78,9.2 U$2.5
N$6
  Top 0.203: U$2.24 30,10.95 29.69,10.64 R7.2
N$7
  Top 0.203: U$2.21 28.96,12.48 25.24,16.19 23.5,16.19 23.48,16.18 | 23.48,16.18 23.48,16.19 22.7,16.19 20.48,18.41 19.37,18.41 17.46,20.32 U$3.1 | 23.48,16.18 23.48,15.55 R10.1
N$8
  Top 0.203: U$2.20 29.08,12.99 25.52,16.55 24.09,16.55 23.57,17.07 R11.1 22.23,17.3 U$3.2
N$9
  Top 0.2: 23.61,12.18 23.61,12.77 | 23.61,12.77 23.65,12.82 | 23.48,12.81 23.52,12.77 23.61,12.77
  Top 0.203: U$3.3 17.46,17.63 18.73,16.36 18.73,13.81 19.25,13.29 23,13.29 23.48,12.81 23.49,12.82 23.65,12.82 25.44,12.82 26.8,11.46 U$2.23 | 23.61,12.18 R12.1
N$10
  Top 0.203: R13.1 | R13.1 21.09,14.13 20.32,14.13 U$3.6 | R13.1 24.27,13.33 25.56,13.33 26.92,11.97 U$2.22
N$11
  Top 0.2: U$3.11 4.92,13.56 4.92,20.95 5.71,21.75 6.83,21.75 17.78,10.79 R8.1
N$12
  Top 0.2: R9.1 17.12,9.52 U$3.10
N$13
  Top 0.203: R16.1 37.77,14.45 37.29,14.92 34.26,14.92 33.78,14.45 U$2.14
N$14
  Top 0.2: 34.74,8.44 C3.1 34.74,8.25
  Top 0.203: 34.74,8.25 C2.1 | U$2.6 34.29,8.89 34.74,8.44
N$15
  Top 0.203: C14.2 35.18,26.17 IC2.4
N$16
  Top 0.203: R14.1 57.31,13.02 58.9,14.6 59.7,14.6 61.16,16.06 D1.A
N$17
  Bottom 0.203: R21.2 42.26,16 44.45,13.81 46.24,13.81 U$1.IO13
N$18
  Top 0.305: 39.31,30.77 IC2.10
  Top 0.406: 39.31,30.77 39.21,30.87 L1.1
N$19  (via drill 0.35)
  Top 0.203: IC3.2 52.05,11.09 46.83,5.88 42.23,5.88 v41.27,4.92
  Bottom 0.203: v41.27,4.92 36.83,9.37 36.83,11.87 32.07,16.63 32.07,18.89 34.03,20.85 IC4.4
N$20
  Top 0.203: D2.A 60.96,18.19 60.96,19.84 59.85,20.95 R18.2
N$21
  Bottom 0.203: R20.2 41.79,16.47 41.79,15.84 43.5,14.13 43.5,12.25 44.31,11.43 48.42,11.43 49.12,10.72 U$1.IO14
N$23
  Top 0.203: C15.1 41.08,25.67 IC2.6
N$25  (via drill 0.35)
  Top 0.305: 36.51,26.67 IC2.3 IC2.2
  Top 0.406: v34.92,28.89 36.04,27.78 36.04,27.15 36.51,26.67 | POWER.2 51.21,31.86 49.52,30.17 C13.1
  Bottom 0.406: v34.92,28.89 34.92,30.64 38.73,34.45 49.35,34.45 51.21,32.59 POWER.2
NRST
  Top 0.203: U$2.15 33.27,14.57 35.53,16.83 C8.1 R5.1
RST  (via drill 0.35)
  Top 0.2: 61.85,25.02 61.85,22.48 61.86,22.46 61.86,12.49 v61.28,11.91 61.28,11.88 61.73,11.43 C9.1 R15.1
  Top 0.203: PROG.2 57.92,28.94 61.85,25.02
  Bottom 0.203: v61.28,11.91 61.91,11.27 61.91,9.45
  Bottom 0.406: U$1.EN 61.91,9.45
RX
  Bottom 0.203: PROG.4 60.42,30.06 59.28,29.92 U$1.RX
RXD0  (via drill 0.35)
  Top 0.203: v42.7,8.73 R2.1
  Bottom 0.203: v42.7,8.73 42.7,8.25 43.83,7.12 52.32,7.12 52.94,7.74 U$1.IO25
RXD1  (via drill 0.35)
  Top 0.203: v44.13,8.1 41.27,8.1 40.64,7.46 R1.1
  Bottom 0.203: v44.13,8.1 44.75,7.48 51.37,7.48 51.66,7.78 U$1.IO26
SPI_CLK  (via drill 0.35)
  Top 0.152: v30.32,31.59 30.26,31.66 SPI_3.3
  Top 0.203: SPI_3.3 SPI_2.3 SPI_1.3 SPI_0.3
  Bottom 0.152: v30.32,31.59 30.36,31.56 30.36,28.54
  Bottom 0.203: R20.1 40.66,17.71 40.66,18.24 30.36,28.54
SPI_CS  (via drill 0.35)
  Top 0.203: IC1.4 32.56,22.69 33.97,21.27 43.95,21.27 v44.13,21.45
  Bottom 0.203: v44.13,21.45 44.13,22.25 44.66,22.78 46.32,22.78 U$1.IO15
SPI_CS0
  Top 0.203: IC1.15 25.12,21.39 21.33,25.18 18.12,25.18 15.6,27.7 12.31,27.7 SPI_0.4
SPI_CS1
  Top 0.203: IC1.14 25.08,22.05 21.61,25.52 21.61,25.54 18.43,25.54 16.09,27.87 16.09,29.3 SPI_1.4
SPI_CS2
  Top 0.203: IC1.13 24.95,22.69 21.97,25.67 21.97,25.68 19.61,28.04 19.61,29.65 SPI_2.4
SPI_CS3
  Top 0.203: SPI_3.4 24.4,29.06 24.4,24.15 25.2,23.35 IC1.12
SPI_MISO
  Top 0.203: SPI_3.2 SPI_2.2 SPI_1.2 SPI_0.2
  Bottom 0.152: 29.2,32.91 SPI_3.2
  Bottom 0.203: 29.2,32.91 29.2,27.81 30.5,26.51 31.75,26.51 39.53,18.73 39.53,17.46 43.02,13.97 43.02,11.95 46.18,8.8 47.69,8.8 47.85,8.96 U$1.IO12
SPI_MOSI  (via drill 0.35)
  Top 0.152: v31.43,29.21 25.8,29.21 SPI_3.5
  Bottom 0.152: v31.43,29.21 31.43,28.23 31.36,28.16
  Bottom 0.203: SPI_0.5 SPI_1.5 SPI_2.5 SPI_3.5 | R21.1 40.92,18.61 31.36,28.16
SW0  (via drill 0.35)
  Top 0.203: R19.1 59.08,11.77 59.54,12.22 SW1.2 59.54,12.22 v60.01,11.75
  Bottom 0.203: v60.01,11.75 60.01,11.27 60.55,10.72 U$1.SENSOR_VP 60.48,9.29 60.48,5.3 59.02,3.84 59.02,3.68 58.87,3.53 53.7,3.53 U$4.5
TX
  Bottom 0.203: PROG.5 61.67,29.89 60.55,29.68 U$1.TX
TX_EN  (via drill 0.35)
  Top 0.203: U$2.16 32.77,14.67 35.88,17.78 47.62,17.78 53.82,23.97 v56.52,23.97
  Bottom 0.203: v56.52,23.97 58.02,25.47 U$1.IO21
TXD0  (via drill 0.35)
  Top 0.203: U$2.17 32.26,14.8 35.72,18.26 47.31,18.26 51.44,22.38 v51.44,22.54
  Bottom 0.203: U$1.IO19 55.48,22.93 54.3,21.75 51.65,21.75 51.44,21.97 v51.44,22.54
TXD1  (via drill 0.35)
  Top 0.203: U$2.18 31.75,14.92 35.56,18.73 46.67,18.73 52.55,24.61 v60.33,24.61
  Bottom 0.203: v60.33,24.61 61.28,24.61 61.83,25.15 U$1.IO22
VCC  (via drill 0.35)
  Top 0.254: 36.04,11.97 U$2.9 | IC2.5 36.67,25.67
  Top 0.406: 36.04,11.97 37.97,10.03 v37.94,10 C4.1 39.03,10.32 39.71,11 R3.1 39.89,11.09 IC3.1 | v32.7,17.46 32.54,17.3 30.19,17.3 L.1 28.61,18.88 C7.1 27.56,20.55 27.56,20.73 | v57.78,22.38 57.63,22.22 R17.2 56.22,21.07 R18.1 | R5.2 R16.2 v40.79,14.45 | 27.56,20.73 IC1.16 | 27.56,20.73 30.81,23.98 IC1.6 34.98,23.98 v36.19,25.2 36.67,25.67 | C12.1 C11.1 39.37,34.92 39.37,35.01 39.21,35.17 L1.2 38.81,35.17 39.37,34.61 v39.37,33.34 | R22.1 v55.88,12.54 | C10.1 62.16,7.37 v63.09,7.37 63.05,7.42 R15.2 | R19.2 59.71,10.77 61.43,9.05 C10.1 | U$6.4 41.68,3.84 37.95,3.84 37.51,3.4 35.19,3.4 34.67,3.92 34.67,4.24 U$5.2 | 60.1,2.95 60.1,4.62 61.43,5.95 C10.1
  Bottom 0.406: v57.78,22.38 58.74,22.38 60.64,20.48 60.64,13.97 | 60.64,13.97 63.09,11.52 U$1.3V3 v63.09,7.37 63.09,7.21 59.48,3.6 59.48,3.49 59.06,3.07 52.03,3.07 50.89,4.21 U$4.6 51.69,3.45 49.07,6.08 43.45,6.08 | 38.73,10.79 43.45,6.08 | v39.37,33.34 39.37,31.91 36.19,28.73 v36.19,25.2 | v32.7,17.46 33.81,17.46 IC4.1 34.13,17.14 34.13,15.4 37.94,11.59 | v40.79,14.45 v40.79,14.43 37.94,11.59 | 37.94,11.59 38.73,10.79 | 38.73,10.79 v37.94,10 | v55.88,12.54 57.31,13.97 60.64,13.97 | U$6.4 42.44,5.07 43.45,6.08
VDD  (via drill 0.35)
  Top 0.406: L.2 v30.16,13.65 30.32,13.49 U$2.19 | R10.2 R13.2 | v25.57,11.75 25.26,12.06 R12.2 | U$2.1 31.75,10.07 31.49,9.81 30.29,9.81 v30.13,9.97 | C5.1 C1.1 R11.2 v25.88,17.3 C6.1
  Top 0.508: v25.72,14.76 24.63,14.76 R10.2
  Bottom 0.406: v30.13,9.97 30.16,10 30.16,11.75 | 30.16,11.75 v30.16,13.65 | 30.16,11.75 v25.57,11.75 25.72,11.89 v25.72,14.76 25.72,17.14 v25.88,17.3 25.56,16.99 U$3.4 18.4,15.71 U$3.5 3.94,15.71 | 3.94,15.71 3.94,21.96 4.96,22.98 U$3.9 | 3.94,15.71 3.94,11.53 5.75,9.73 U$3.12
WSLED_OUT
  Bottom 0.203: IC4.2 31.14,16.94 31.14,7.11 U$5.3

### Text on the board
tPlace: SPI0 | SPI1 | SPI2 | SPI3 | SPI4 | SPI5 | SPI6 | SPI7 | GND | Vin | GND | RST | G0 | RX | TX | GND | MI | CLK | CS | MO | MASTER BOARD / V2.1 - LAAS CNRS | 3.3V | IO32/TX1 | I35/RX1 | GND | 3.3V | SW0 | IO33 | IO2 | I34 | GND | WS_LED | 3.3V | GND
bPlace: SPI0 | SPI1 | SPI2 | SPI3 | SPI4 | SPI5 | SPI6 | SPI7 | GND | Vin | GND | RST | G0 | RX | TX | GND | MI | CLK | CS | MO | MASTER BOARD / V2.2 - LAAS CNRS | WS_LED | 3.3V | GND | 3.3V | IO32/TX1 | I35/RX1 | GND | 3.3V | SW0 | IO33 | IO2 | I34 | GND
tNames: .
bNames: github.com/open-dynamic-robot-initiative